# Altium schematic sheet APM9328_CONNECTOR.SchDoc: CONNECTOR TOP
size A4; Author: NC; Revision: 1.0; SheetNumber: 6; SheetTotal: 14
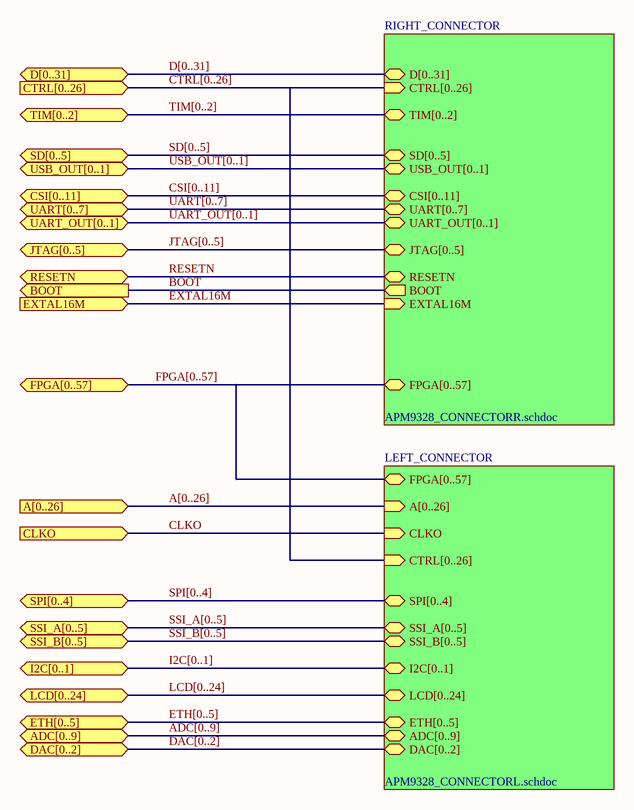
[diagram p0: APM9328_CONNECTOR.SchDoc]

## Sub-sheets
LEFT_CONNECTOR = APM9328_CONNECTORL.schdoc: A[0..26] (in), LCD[0..24] (bidir), SSI_B[0..5] (bidir), SPI[0..4] (bidir), SSI_A[0..5] (bidir), FPGA[0..57] (bidir), ETH[0..5] (bidir), ADC[0..9] (bidir), DAC[0..2] (bidir), I2C[0..1] (bidir), CLKO (in), CTRL[0..26] (in)
RIGHT_CONNECTOR = APM9328_CONNECTORR.schdoc: BOOT (out), USB_OUT[0..1] (bidir), CTRL[0..26] (in), D[0..31] (bidir), EXTAL16M (in), JTAG[0..5] (bidir), TIM[0..2] (bidir), CSI[0..11] (bidir), UART[0..7] (bidir), UART_OUT[0..1] (bidir), SD[0..5] (bidir), RESETN (bidir), FPGA[0..57] (bidir)

## Ports
A[0..26] (in), ADC[0..9] (bidir), BOOT (out), CLKO (in), CSI[0..11] (bidir), CTRL[0..26] (in), D[0..31] (bidir), DAC[0..2] (bidir), ETH[0..5] (bidir), EXTAL16M (in), FPGA[0..57] (bidir), I2C[0..1] (bidir), JTAG[0..5] (bidir), LCD[0..24] (bidir), RESETN (bidir), SD[0..5] (bidir), SPI[0..4] (bidir), SSI_A[0..5] (bidir), SSI_B[0..5] (bidir), TIM[0..2] (bidir), UART[0..7] (bidir), UART_OUT[0..1] (bidir), USB_OUT[0..1] (bidir)

## Nets
BOOT: port BOOT, sheet RIGHT_CONNECTOR/BOOT
CLKO: port CLKO, sheet LEFT_CONNECTOR/CLKO
EXTAL16M: port EXTAL16M, sheet RIGHT_CONNECTOR/EXTAL16M
RESETN: port RESETN, sheet RIGHT_CONNECTOR/RESETN

## Buses and harness runs
bus A[0..26] = port A[0..26] = sheet LEFT_CONNECTOR/A[0..26]
bus ADC[0..9] = port ADC[0..9] = sheet LEFT_CONNECTOR/ADC[0..9]
bus CSI[0..11] = port CSI[0..11] = sheet RIGHT_CONNECTOR/CSI[0..11]
bus CTRL[0..26] = port CTRL[0..26] = sheet LEFT_CONNECTOR/CTRL[0..26] = sheet RIGHT_CONNECTOR/CTRL[0..26]
bus D[0..31] = port D[0..31] = sheet RIGHT_CONNECTOR/D[0..31]
bus DAC[0..2] = port DAC[0..2] = sheet LEFT_CONNECTOR/DAC[0..2]
bus ETH[0..5] = port ETH[0..5] = sheet LEFT_CONNECTOR/ETH[0..5]
bus FPGA[0..57] = port FPGA[0..57] = sheet LEFT_CONNECTOR/FPGA[0..57] = sheet RIGHT_CONNECTOR/FPGA[0..57]
bus I2C[0..1] = port I2C[0..1] = sheet LEFT_CONNECTOR/I2C[0..1]
bus JTAG[0..5] = port JTAG[0..5] = sheet RIGHT_CONNECTOR/JTAG[0..5]
bus LCD[0..24] = port LCD[0..24] = sheet LEFT_CONNECTOR/LCD[0..24]
bus SD[0..5] = port SD[0..5] = sheet RIGHT_CONNECTOR/SD[0..5]
bus SPI[0..4] = port SPI[0..4] = sheet LEFT_CONNECTOR/SPI[0..4]
bus SSI_A[0..5] = port SSI_A[0..5] = sheet LEFT_CONNECTOR/SSI_A[0..5]
bus SSI_B[0..5] = port SSI_B[0..5] = sheet LEFT_CONNECTOR/SSI_B[0..5]
bus TIM[0..2] = port TIM[0..2] = sheet RIGHT_CONNECTOR/TIM[0..2]
bus UART[0..7] = port UART[0..7] = sheet RIGHT_CONNECTOR/UART[0..7]
bus UART_OUT[0..1] = port UART_OUT[0..1] = sheet RIGHT_CONNECTOR/UART_OUT[0..1]
bus USB_OUT[0..1] = port USB_OUT[0..1] = sheet RIGHT_CONNECTOR/USB_OUT[0..1]

## Notes on the sheet
- Title
- Size:
- Date:
- A4
- Author:
- Revision:
- Sheet
- of
- Armadeus Embedded Solutions
- File: